# Altium schematic sheet STM32F103C8T6.SchDoc
size 241 x 203 mm; SheetNumber: 1; SheetTotal: 5
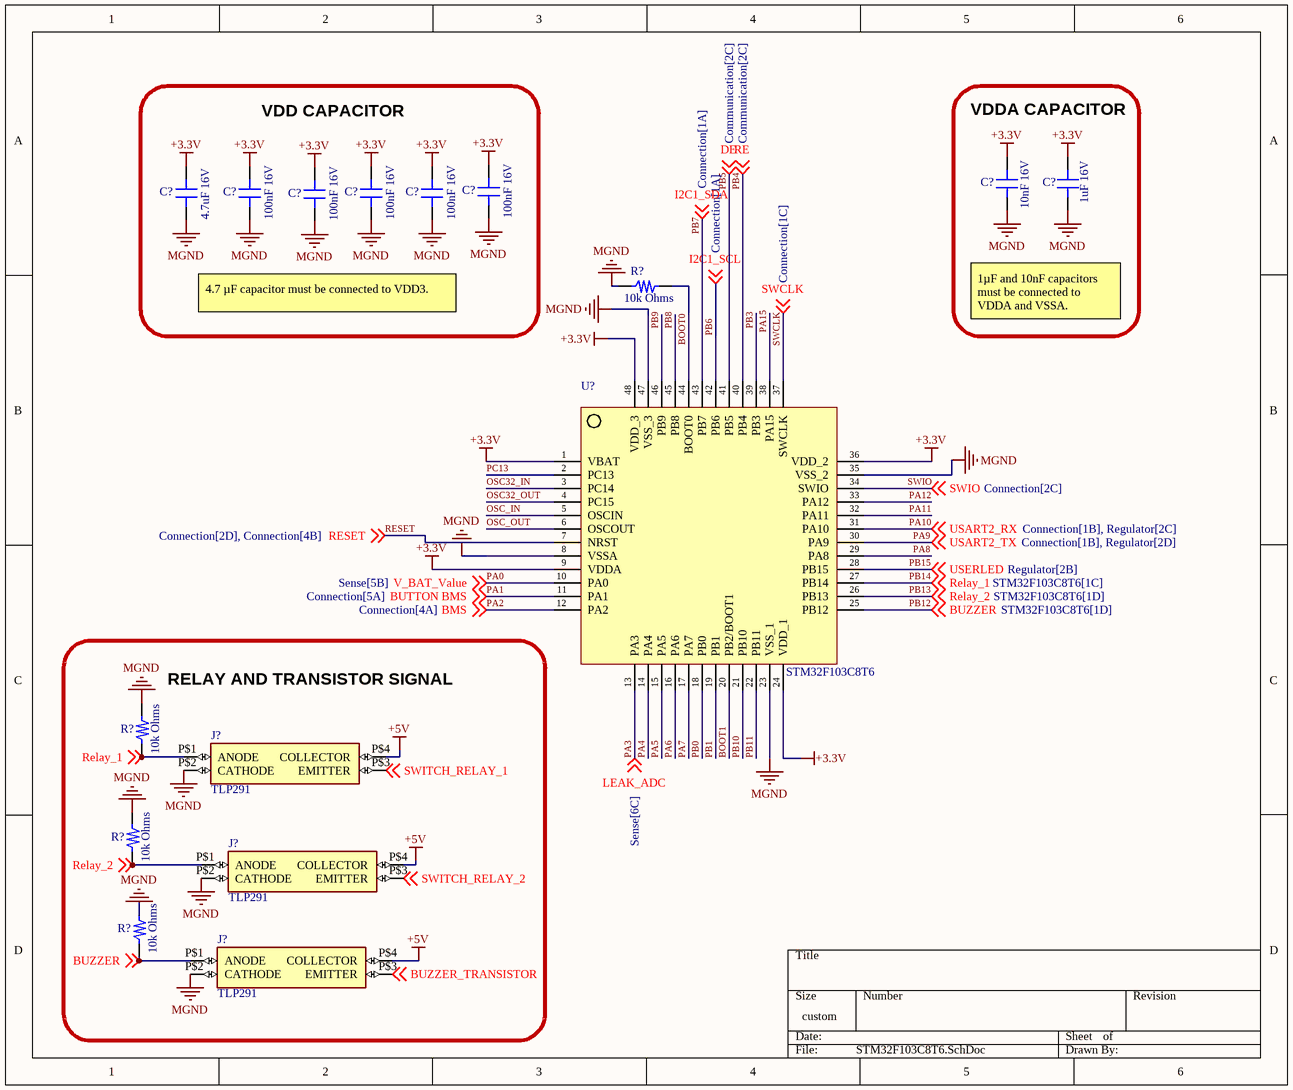
[diagram p0: STM32F103C8T6.SchDoc]

## Parts
(Parts that share a designator on the sheet are numbered #1, #2 ... from top to bottom, then left to right.)
C?#1  10nF 16V  [0603_CAP]
C?#2  1uF 16V  [0603_CAP]
C?#3  4.7uF 16V  [0603_CAP]
C?#4  100nF 16V  [0603_CAP]
C?#5  100nF 16V  [0603_CAP]
C?#6  100nF 16V  [0603_CAP]
C?#7  100nF 16V  [0603_CAP]
C?#8  100nF 16V  [0603_CAP]
J?#1  TLP291  [11-3C1]
J?#2  TLP291  [11-3C1]
J?#3  TLP291  [11-3C1]
R?#1  10k Ohms  [0603_RES]
R?#2  10k Ohms  [0603_RES]
R?#3  10k Ohms  [0603_RES]
R?#4  10k Ohms  [0603_RES]
U?  STM32F103C8T6  [LQFP48]

## Blocks framed on the sheet
VDD CAPACITOR: C?#3-C?#8
VDDA CAPACITOR: C?#1 C?#2
RELAY AND TRANSISTOR SIGNAL: J?#1-J?#3 R?#2-R?#4

## Nets
+3.3V: C?#1.2 C?#2.2 C?#3.2 C?#4.2 C?#5.2 C?#6.2 C?#7.2 C?#8.2 U?.1(VBAT) U?.9(VDDA) U?.24(VDD_1) U?.36(VDD_2) U?.48(VDD_3)
+5V: J?#1.P$4(COLLECTOR) J?#2.P$4(COLLECTOR) J?#3.P$4(COLLECTOR)
MGND: C?#1.1 C?#2.1 C?#3.1 C?#4.1 C?#5.1 C?#6.1 C?#7.1 C?#8.1 J?#1.P$2(CATHODE) J?#2.P$2(CATHODE) J?#3.P$2(CATHODE) R?#1.2 R?#2.1 R?#4.1 U?.8(VSSA) U?.23(VSS_1) U?.35(VSS_2) U?.47(VSS_3)
BOOT0: R?#1.1 U?.44(BOOT0)
BOOT1: U?.20(PB2/BOOT1)
BUZZER_TRANSISTOR: J?#3.P$3(EMITTER) ; off-sheet BUZZER_TRANSISTOR
OSC32_IN: U?.3(PC14)
OSC32_OUT: U?.4(PC15)
OSC_IN: U?.5(OSCIN)
OSC_OUT: U?.6(OSCOUT)
PA0: U?.10(PA0) ; off-sheet V_BAT_Value  [also labelled V_BAT_Value]
PA1: U?.11(PA1) ; off-sheet BUTTON BMS  [also labelled BUTTON BMS]
PA2: U?.12(PA2) ; off-sheet BMS  [also labelled BMS]
PA3: U?.13(PA3) ; off-sheet LEAK_ADC  [also labelled LEAK_ADC]
PA4: U?.14(PA4)
PA5: U?.15(PA5)
PA6: U?.16(PA6)
PA7: U?.17(PA7)
PA8: U?.29(PA8)
PA9: U?.30(PA9) ; off-sheet USART2_TX  [also labelled USART2_TX]
PA10: U?.31(PA10) ; off-sheet USART2_RX  [also labelled USART2_RX]
PA11: U?.32(PA11)
PA12: U?.33(PA12)
PA15: U?.38(PA15)
PB0: U?.18(PB0)
PB1: U?.19(PB1)
PB3: U?.39(PB3)
PB4: U?.40(PB4) ; off-sheet RE  [also labelled RE]
PB5: U?.41(PB5) ; off-sheet DE  [also labelled DE]
PB6: U?.42(PB6) ; off-sheet I2C1_SCL  [also labelled I2C1_SCL]
PB7: U?.43(PB7) ; off-sheet I2C1_SDA  [also labelled I2C1_SDA]
PB8: U?.45(PB8)
PB9: U?.46(PB9)
PB10: U?.21(PB10)
PB11: U?.22(PB11)
PB12: J?#3.P$1(ANODE) R?#4.2 U?.25(PB12) ; off-sheet BUZZER  [also labelled BUZZER]
PB13: J?#2.P$1(ANODE) R?#3.2 U?.26(PB13) ; off-sheet Relay_2  [also labelled Relay_2]
PB14: J?#1.P$1(ANODE) R?#2.2 U?.27(PB14) ; off-sheet Relay_1  [also labelled Relay_1]
PB15: U?.28(PB15) ; off-sheet USERLED  [also labelled USERLED]
PC13: U?.2(PC13)
RESET: U?.7(NRST) ; off-sheet RESET
SWCLK: U?.37(SWCLK) ; off-sheet SWCLK
SWIO: U?.34(SWIO) ; off-sheet SWIO
SWITCH_RELAY_1: J?#1.P$3(EMITTER) ; off-sheet SWITCH_RELAY_1
SWITCH_RELAY_2: J?#2.P$3(EMITTER) ; off-sheet SWITCH_RELAY_2

Not connected (* = marked no-connect by the designer): R?#3 1

## Notes on the sheet
- 4.7 µF capacitor must be connected to VDD3.
- 1µF and 10nF capacitors must be connected to VDDA and VSSA.
- Labels drawn without touching a wire or pin: MGND

## Library data of the parts
C?#1 C?#2 = CAP_0603: CL10B105KO8NNNC - MLCC (1608) 0603 1uF 16VDC ±10% X7R
  C?#1: Value: 10nF 16V
  C?#2: Value: 1uF 16V
C?#3-C?#8 = CAP_0603: CL10B105KO8NNNC - MLCC (1608) 0603 1uF 16VDC ±10% X7R; Value: 10nF 16V
J?#1-J?#3 = TLP291: Optoisolator Transistor Output 2500Vrms 4 Channel 16-SO; MF: Toshiba Semiconductor; SnapEDA_Link: https://www.snapeda.com/parts/TLP291/Toshiba/view-part/?ref=snap; Package: SOIC-4 Toshiba; Value: *; MP: TLP291; Check_prices: https://www.snapeda.com/parts/TLP291/Toshiba/view-part/?ref=eda
R?#1-R?#4 = RES_0603: 0603; Power: 1/8W; Value: 10k Ohms
U? = STM32F103C8T6: IC-32F103 ARM 64KB FLASH MEM 48-LQFP; ComponentLink1Description: New link; ComponentLink1URL: https://ozdisan.com/entegre-devreler-ics/embedded-entegreler/mikroislemciler/STM32F103C8T6